# Altium project Carte_extension.PrjPcb
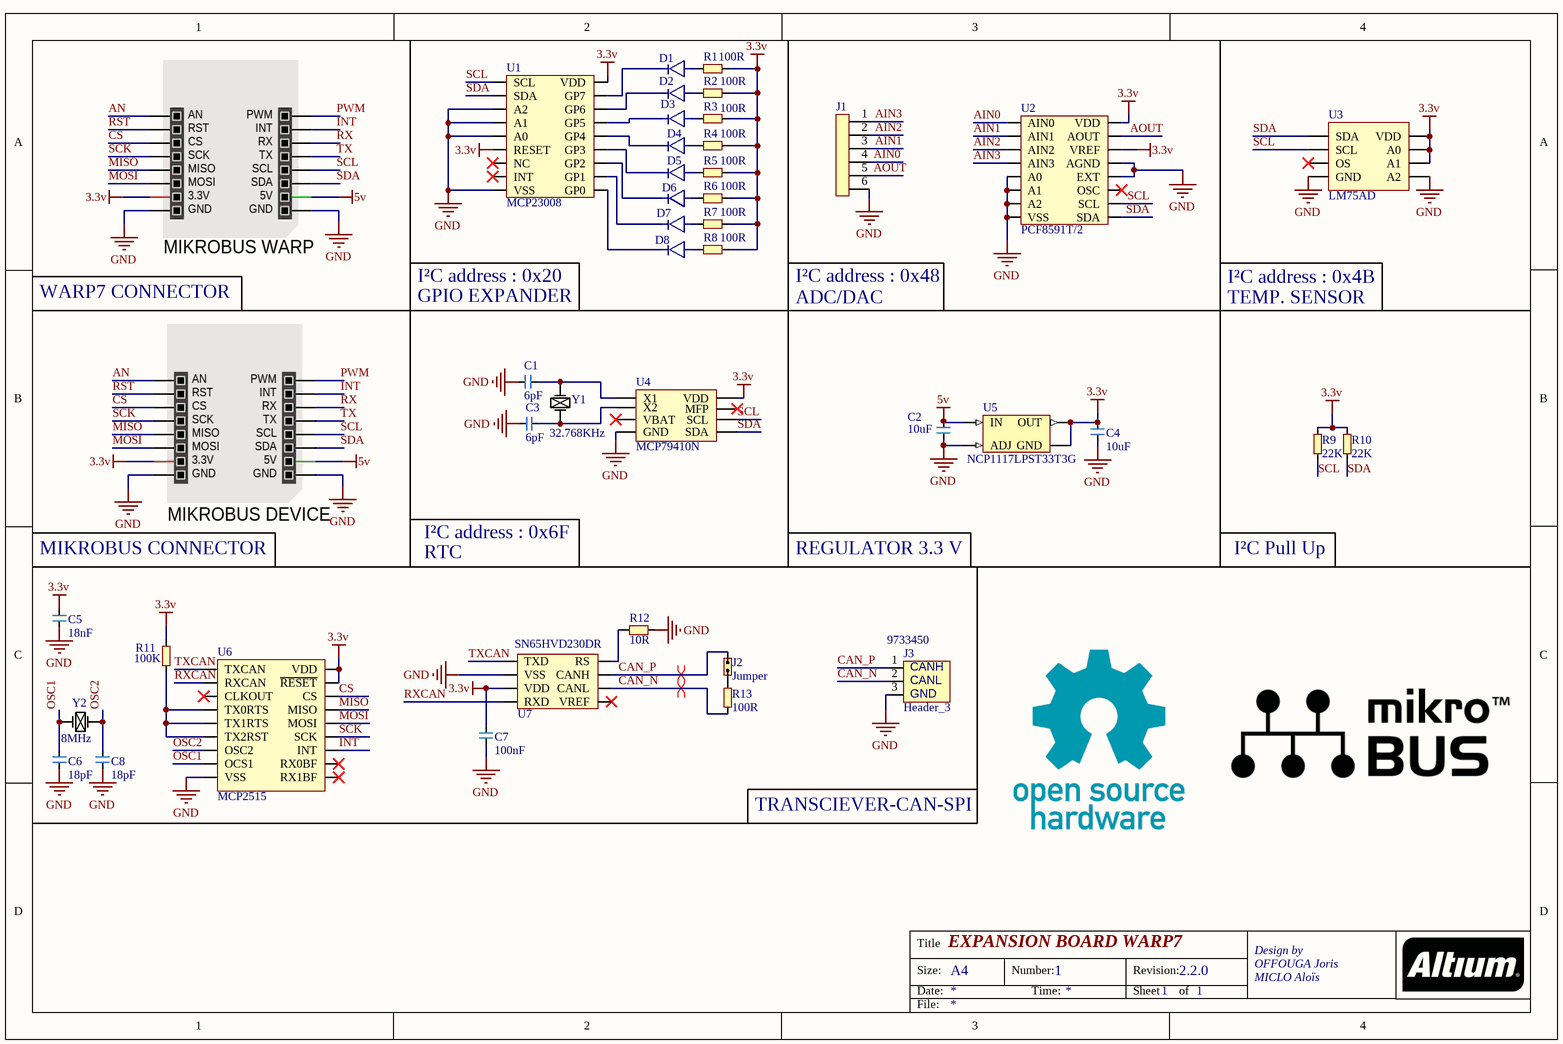
[diagram p0: Sheet1.SchDoc]
1 sheet, 43 parts. Net scope: global (net labels, ports and power ports of the same name join across sheets).
Board file: PCB1.PcbDoc

## Sheet Sheet1.SchDoc: EXPANSION BOARD WARP7
size A4; ApprovedBy: TEXIER PIERRE-JEAN; CheckedBy: MICLO ALOIS; Author: OFFOUGA JORIS; DrawnBy: OFFOUGA JORIS / MICLO ALOIS; Address1: Design by; Address2: OFFOUGA Joris; Address3: MICLO Aloïs; DocumentNumber: 1; Revision: 2.2.0; SheetNumber: 1; SheetTotal: 1; ImagePath: C:\Users\alois\OneDrive\Bureau\OH.png

### Parts
C1  6pF  [0805]
C2  10uF  [0805]
C3  6pF  [0805]
C4  10uF  [0805]
C5  18nF  [0805]
C6  18pF  [0805]
C7  100nF  [0805]
C8  18pF  [0805]
D1  Diode  [led]  (value not drawn)
D2  Diode  [led]  (value not drawn)
D3  Diode  [led]  (value not drawn)
D4  Diode  [led]  (value not drawn)
D5  Diode  [led]  (value not drawn)
D6  Diode  [led]  (value not drawn)
D7  Diode  [led]  (value not drawn)
D8  Diode  [led]  (value not drawn)
J1  Header_6  [Header 6]  (value not drawn)
J2  Jumper  [Header 2]
J3  Header_3  Supplier Part Number 1: 9733450  [Header 3]
MIKROBUS_DEVICE  MIKROBUS HOST CONN.  [MIKROBUS HOST CONN.]  (value not drawn)
MIKROBUS_WARP  MIKROBUS HOST CONN.  [MIKROBUS WARP CONN.]  (value not drawn)
R1  100R  [0805]
R2  100R  [0805]
R3  100R  [0805]
R4  100R  [0805]
R5  100R  [0805]
R6  100R  [0805]
R7  100R  [0805]
R8  100R  [0805]
R9  22K  [0805]
R10  22K  [0805]
R11  100K  [0805]
R12  10R  [0805]
R13  100R  [0805]
U1  MCP23008  [SOIC 18]
U2  PCF8591T/2  [SOIC 16]
U3  LM75AD  [SOIC 8]
U4  MCP79410N  [SOIC 8]
U5  NCP1117LPST33T3G  [SOT-223]
U6  MCP2515  [SOIC 18]
U7  SN65HVD230DR  [SOIC 8]
Y1  32.768KHz  [ABS-07]
Y2  8MHz  [QUARTZ_CMS_6.2x3.7]

### Nets
3.3v: C4.1 C5.1 C7.2 MIKROBUS_DEVICE.7(3.3V) MIKROBUS_WARP.7(3.3V) R1.2 R2.2 R3.2 R4.2 R5.2 R6.2 R7.2 R8.2 R9.2 R10.2 R11.2 U1.6(RESET) U1.18(VDD) U2.14(VREF) U2.16(VDD) U3.6(A1) U3.7(A0) U3.8(VDD) U4.8(VDD) U5.2(OUT) U5.4(GND) U6.17(~{RESET}) U6.18(VDD) U7.3(VDD)
5v: C2.1 MIKROBUS_DEVICE.10(5V) MIKROBUS_WARP.10(5V) U5.3(IN)
GND: C1.2 C2.2 C3.2 C4.2 C5.2 C6.1 C7.1 C8.1 J1.6 J3.3 MIKROBUS_DEVICE.8(GND) MIKROBUS_DEVICE.9(GND) MIKROBUS_WARP.8(GND) MIKROBUS_WARP.9(GND) R12.1 U1.3(A2) U1.4(A1) U1.5(A0) U1.9(VSS) U2.5(A0) U2.6(A1) U2.7(A2) U2.8(VSS) U2.12(EXT) U2.13(AGND) U3.4(GND) U3.5(A2) U4.4(GND) U5.1(ADJ) U6.9(VSS) U7.2(VSS)
AIN0: J1.4 U2.1(AIN0)
AIN1: J1.3 U2.2(AIN1)
AIN2: J1.2 U2.3(AIN2)
AIN3: J1.1 U2.4(AIN3)
AN: MIKROBUS_DEVICE.1(AN) MIKROBUS_WARP.1(AN)
AOUT: J1.5 U2.15(AOUT)
CAN_N: J3.2 R13.1 U7.6(CANL)
CAN_P: J2.1 J3.1 U7.7(CANH)
CS: MIKROBUS_DEVICE.3(CS) MIKROBUS_WARP.3(CS) U6.16(CS)
INT: MIKROBUS_DEVICE.15(INT) MIKROBUS_WARP.15(INT) U6.12(INT)
MISO: MIKROBUS_DEVICE.5(MISO) MIKROBUS_WARP.5(MISO) U6.15(MISO)
MOSI: MIKROBUS_DEVICE.6(MOSI) MIKROBUS_WARP.6(MOSI) U6.14(MOSI)
OSC1: C6.2 U6.8(OCS1) Y2.1
OSC2: C8.2 U6.7(OSC2) Y2.2
PWM: MIKROBUS_DEVICE.16(PWM) MIKROBUS_WARP.16(PWM)
RST: MIKROBUS_DEVICE.2(RST) MIKROBUS_WARP.2(RST)
RX: MIKROBUS_DEVICE.14(RX) MIKROBUS_WARP.14(RX)
RXCAN: U6.2(RXCAN) U7.4(RXD)
SCK: MIKROBUS_DEVICE.4(SCK) MIKROBUS_WARP.4(SCK) U6.13(SCK)
SCL: MIKROBUS_DEVICE.12(SCL) MIKROBUS_WARP.12(SCL) R9.1 U1.1(SCL) U2.10(SCL) U3.2(SCL) U4.6(SCL)
SDA: MIKROBUS_DEVICE.11(SDA) MIKROBUS_WARP.11(SDA) R10.1 U1.2(SDA) U2.9(SDA) U3.1(SDA) U4.5(SDA)
TX: MIKROBUS_DEVICE.13(TX) MIKROBUS_WARP.13(TX)
TXCAN: U6.1(TXCAN) U7.1(TXD)
NetC1_1: C1.1 U4.1(X1) Y1.1
NetC3_1: C3.1 U4.2(X2) Y1.2
NetD1_1: D1.1 R1.1
NetD1_2: D1.2 U1.17(GP7)
NetD2_1: D2.1 R2.1
NetD2_2: D2.2 U1.16(GP6)
NetD3_1: D3.1 R3.1
NetD3_2: D3.2 U1.15(GP5)
NetD4_1: D4.1 R4.1
NetD4_2: D4.2 U1.14(GP4)
NetD5_1: D5.1 R5.1
NetD5_2: D5.2 U1.13(GP3)
NetD6_1: D6.1 R6.1
NetD6_2: D6.2 U1.12(GP2)
NetD7_1: D7.1 R7.1
NetD7_2: D7.2 U1.11(GP1)
NetD8_1: D8.1 R8.1
NetD8_2: D8.2 U1.10(GP0)
NetJ2_2: J2.2 R13.2
NetR11_1: R11.1 U6.4(TX0RTS) U6.5(TX1RTS) U6.6(TX2RST)
NetR12_2: R12.2 U7.8(RS)

Not connected (* = marked no-connect by the designer): U1 7(NC)* 8(INT)*; U2 11(OSC)*; U3 3(OS)*; U4 3(VBAT)* 7(MFP)*; U6 3(CLKOUT)* 10(RX1BF)* 11(RX0BF)*; U7 5(VREF)*

### Layout directives
differential pair: CAN_N, CAN_P

### Notes on the sheet
- WARP7 CONNECTOR
- GPIO EXPANDER
- I²C address : 0x20
- ADC/DAC
- I²C address : 0x48
- TEMP. SENSOR
- I²C address : 0x4B
- MIKROBUS CONNECTOR
- RTC
- I²C address : 0x6F
- REGULATOR 3.3 V
- I²C Pull Up
- TRANSCIEVER-CAN-SPI
- Title
- Size:
- Date:
- A4
- Number:
- Time:
- Revision:
- Sheet
- of
- File:
- (in symbol Header_3) CANH; CANL; GND

### Library data of the parts
C1-C8 = Condensateur: Supplier 1: Farnell
  C1 C3: Supplier Part Number 1: 1759185
  C2 C4: Supplier Part Number 1: 9402144
  C5: Supplier Part Number 1: 1759251
  C6 C8: Supplier Part Number 1: 2310683
  C7: Supplier Part Number 1: 2522443
D1-D8 = Diode: led; Supplier 1: Farnell; Supplier Part Number 1: 2614990
MIKROBUS_DEVICE MIKROBUS_WARP = MIKROBUS HOST CONN._1: mikroBUS Host Socket; SMD: No; Supplier 1: Farnell
  MIKROBUS_DEVICE: Supplier Part Number 1: 1593463
  MIKROBUS_WARP: Supplier Part Number 1: 9733345
R1-R13 = Resistance: Supplier 1: Farnell
  R1-R8 R13: Supplier Part Number 1: 2693130
  R9 R10: Supplier Part Number 1: 2447607
  R11: Supplier Part Number 1: 2123382
  R12: Supplier Part Number 1: 2446873
U4 = MCP7940N: Supplier 1: Farnell; Supplier Part Number 1: 2361122
Y1 Y2 = Quartz: Supplier 1: Farnell
  Y1: Supplier Part Number 1: 2467864
  Y2: Supplier Part Number 1: 2832065
J1 = Header_6: Supplier 1: Farnell; Supplier Part Number 1: 2751311
J2 = Jumper: Supplier 1: Farnell; Supplier Part Number 1: 9733302
J3 = Header_3: Supplier 1: Farnell
U1 = MCP23008: Supplier 1: Farnell; Supplier Part Number 1: 2851556
U2 = PCF8591T/2: Supplier 1: Farnell; Supplier Part Number 1: 2400442
U3 = LM75AD: Supplier 1: Farnell; Supplier Part Number 1: 1854077
U5 = NCP1117LPST33T3G: Supplier 1: Farnell; Supplier Part Number 1: 2534283
U7 = SN65HVD230DR: Supplier 1: Farnell; Supplier Part Number 1: 8452148